# Altium project FPGA Board.PrjPcb (part 4 of 4)
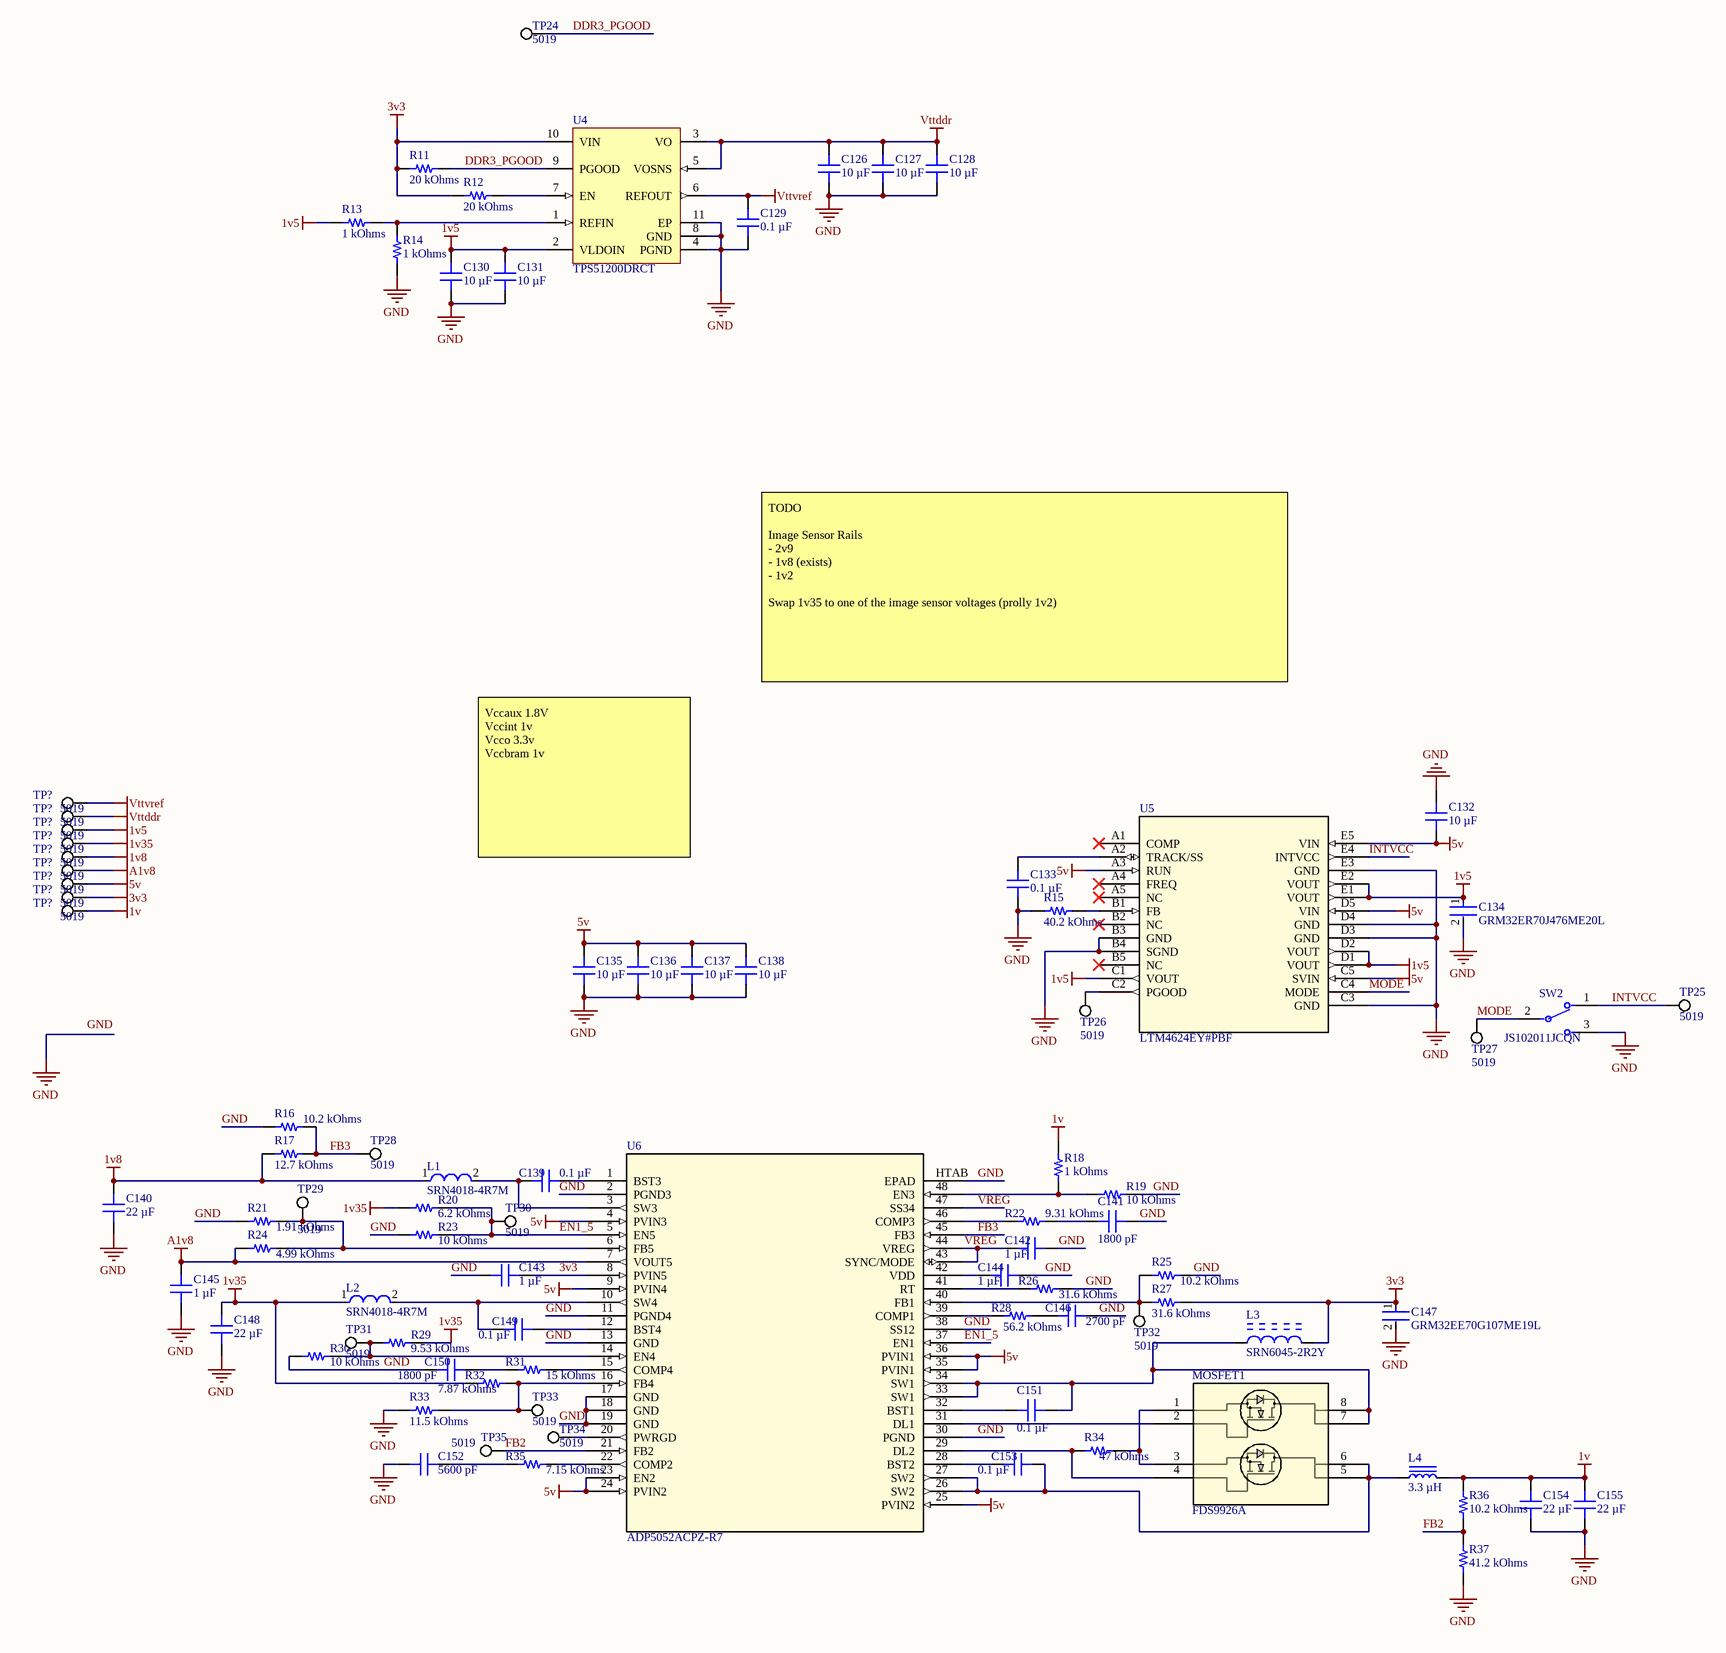
[diagram p8: FPGA Power.SchDoc]

## Nets that join several sheets
3v3: FPGA Board Top (6 pins), A200T Top Level (78 pins), FPGA RAM (J1.199), Motherboard Connection (J2.15 J2.16 J2.17 J2.18), FPGA Power (9 pins)
5v: Motherboard Connection (10 pins), FPGA Power (17 pins)
A1v8: A200T Top Level (C123.2 FB2.1), Motherboard Connection (J2.21), FPGA Power (C145.1 R24.1 TP?#6.1 U6.7)
DM0: FPGA Board Top (7 pins), A200T Top Level (202 pins), FPGA RAM (87 pins), Motherboard Connection (42 pins), FPGA Power (56 pins)
Vccaux: A200T Top Level (14 pins), Motherboard Connection (J2.11 J2.12), FPGA Power (C140.2 L1.1 R17.1 TP?#5.1)
Vccbram: A200T Top Level (48 pins), Motherboard Connection (J2.1 J2.2 J2.3 J2.4), FPGA Power (6 pins)
Vdd: A200T Top Level (18 pins), FPGA RAM (29 pins), Motherboard Connection (J2.107 J2.109), FPGA Power (11 pins)
Vrefca: FPGA RAM (J1.1 J1.126), Motherboard Connection (J2.113), FPGA Power (C129.2 TP?#1.1 U4.6)
Vtt: FPGA RAM (14 pins), Motherboard Connection (J2.111), FPGA Power (6 pins)
A0: A200T Top Level (U2.K22), FPGA RAM (J1.98)
A1: A200T Top Level (U2.K21), FPGA RAM (J1.97)
A2: A200T Top Level (U2.G20), FPGA RAM (J1.96)
A3: A200T Top Level (U2.H20), FPGA RAM (J1.95)
A4: A200T Top Level (U2.H22), FPGA RAM (J1.92)
A5: A200T Top Level (U2.J22), FPGA RAM (J1.91)
A6: A200T Top Level (U2.H18), FPGA RAM (J1.90)
A7: A200T Top Level (U2.H17), FPGA RAM (J1.86)
A8: A200T Top Level (U2.H15), FPGA RAM (J1.89)
A9: A200T Top Level (U2.J15), FPGA RAM (J1.85)
A10: A200T Top Level (U2.G18), FPGA RAM (J1.107)
A11: A200T Top Level (U2.G17), FPGA RAM (J1.84)
A12: A200T Top Level (U2.G16), FPGA RAM (J1.83)
A13: A200T Top Level (U2.G15), FPGA RAM (J1.119)
A14: A200T Top Level (U2.G13), FPGA RAM (J1.80)
A15: A200T Top Level (U2.H13), FPGA RAM (J1.78)
B0: A200T Top Level (U2.AB2), Motherboard Connection (J2.53)
B1: A200T Top Level (U2.Y3), Motherboard Connection (J2.55)
B2: A200T Top Level (U2.AA3), Motherboard Connection (J2.57)
B3: A200T Top Level (U2.AA5), Motherboard Connection (J2.59)
B4: A200T Top Level (U2.AB5), Motherboard Connection (J2.54)
B5: A200T Top Level (U2.Y4), Motherboard Connection (J2.56)
B6: A200T Top Level (U2.AA4), Motherboard Connection (J2.58)
B7: A200T Top Level (U2.V4), Motherboard Connection (J2.60)
BA0: A200T Top Level (U2.J20), FPGA RAM (J1.109)
BA1: A200T Top Level (U2.L21), FPGA RAM (J1.108)
BA2: A200T Top Level (U2.M21), FPGA RAM (J1.79)
CAS: A200T Top Level (U2.J19), FPGA RAM (J1.115)
CCLK: A200T Top Level (U2.L12), Motherboard Connection (J2.30)
CK0_N: A200T Top Level (U2.H14), FPGA RAM (J1.103)
CK0_P: A200T Top Level (U2.J14), FPGA RAM (J1.101)
CK1_N: A200T Top Level (U2.N19), FPGA RAM (J1.104)
CK1_P: A200T Top Level (U2.N18), FPGA RAM (J1.102)
CKE0: A200T Top Level (U2.M22), FPGA RAM (J1.73 R8.1)
CKE1: A200T Top Level (U2.K18), FPGA RAM (J1.74 R7.1)
CLK0: FPGA Board Top (Q1.3), A200T Top Level (U2.T5)
CS0: A200T Top Level (U2.N22), FPGA RAM (J1.114)
CS1: A200T Top Level (U2.K19), FPGA RAM (J1.121)
D2: A200T Top Level (U2.P21), Motherboard Connection (J2.33)
D3: A200T Top Level (U2.R21), Motherboard Connection (J2.34)
DCLK: A200T Top Level (U2.AA8), Motherboard Connection (J2.67)
DE: A200T Top Level (U2.W9), Motherboard Connection (J2.68)
DISP: A200T Top Level (U2.Y7), Motherboard Connection (J2.66)
DONE: A200T Top Level (5 pins), Motherboard Connection (J2.96)
DQ0: A200T Top Level (U2.F13), FPGA RAM (J1.5)
DQ1: A200T Top Level (U2.F14), FPGA RAM (J1.7)
DQ2: A200T Top Level (U2.F16), FPGA RAM (J1.15)
DQ3: A200T Top Level (U2.E17), FPGA RAM (J1.17)
DQ4: A200T Top Level (U2.E13), FPGA RAM (J1.4)
DQ5: A200T Top Level (U2.E14), FPGA RAM (J1.6)
DQ6: A200T Top Level (U2.E16), FPGA RAM (J1.16)
DQ7: A200T Top Level (U2.D16), FPGA RAM (J1.18)
DQ8: A200T Top Level (U2.B15), FPGA RAM (J1.21)
DQ9: A200T Top Level (U2.B16), FPGA RAM (J1.23)
DQ10: A200T Top Level (U2.C13), FPGA RAM (J1.33)
DQ11: A200T Top Level (U2.B13), FPGA RAM (J1.35)
DQ12: A200T Top Level (U2.A13), FPGA RAM (J1.22)
DQ13: A200T Top Level (U2.A14), FPGA RAM (J1.24)
DQ14: A200T Top Level (U2.B17), FPGA RAM (J1.34)
DQ15: A200T Top Level (U2.B18), FPGA RAM (J1.36)
DQ16: A200T Top Level (U2.E19), FPGA RAM (J1.39)
DQ17: A200T Top Level (U2.D19), FPGA RAM (J1.41)
DQ18: A200T Top Level (U2.B20), FPGA RAM (J1.51)
DQ19: A200T Top Level (U2.A20), FPGA RAM (J1.53)
DQ20: A200T Top Level (U2.A18), FPGA RAM (J1.40)
DQ21: A200T Top Level (U2.A19), FPGA RAM (J1.42)
DQ22: A200T Top Level (U2.F19), FPGA RAM (J1.50)
DQ23: A200T Top Level (U2.F20), FPGA RAM (J1.52)
DQ24: A200T Top Level (U2.D20), FPGA RAM (J1.57)
DQ25: A200T Top Level (U2.C20), FPGA RAM (J1.59)
DQ26: A200T Top Level (U2.C22), FPGA RAM (J1.67)
DQ27: A200T Top Level (U2.B22), FPGA RAM (J1.69)
DQ28: A200T Top Level (U2.E22), FPGA RAM (J1.56)
DQ29: A200T Top Level (U2.D22), FPGA RAM (J1.58)
DQ30: A200T Top Level (U2.E21), FPGA RAM (J1.68)
DQ31: A200T Top Level (U2.D21), FPGA RAM (J1.70)
DQ32: A200T Top Level (U2.K13), FPGA RAM (J1.129)
DQ33: A200T Top Level (U2.K14), FPGA RAM (J1.131)
DQ34: A200T Top Level (U2.M13), FPGA RAM (J1.141)
DQ35: A200T Top Level (U2.L13), FPGA RAM (J1.143)
DQ36: A200T Top Level (U2.L14), FPGA RAM (J1.130)
DQ37: A200T Top Level (U2.L15), FPGA RAM (J1.132)
DQ38: A200T Top Level (U2.L16), FPGA RAM (J1.140)
DQ39: A200T Top Level (U2.K16), FPGA RAM (J1.142)
DQ40: A200T Top Level (U2.W21), FPGA RAM (J1.147)
DQ41: A200T Top Level (U2.W22), FPGA RAM (J1.149)
DQ42: A200T Top Level (U2.AA20), FPGA RAM (J1.157)
DQ43: A200T Top Level (U2.AA21), FPGA RAM (J1.159)
DQ44: A200T Top Level (U2.AB21), FPGA RAM (J1.146)
DQ45: A200T Top Level (U2.AB22), FPGA RAM (J1.148)
DQ46: A200T Top Level (U2.U20), FPGA RAM (J1.158)
DQ47: A200T Top Level (U2.V20), FPGA RAM (J1.160)
DQ48: A200T Top Level (U2.V18), FPGA RAM (J1.163)
DQ49: A200T Top Level (U2.V19), FPGA RAM (J1.165)
DQ50: A200T Top Level (U2.V17), FPGA RAM (J1.175)
DQ51: A200T Top Level (U2.W17), FPGA RAM (J1.177)
DQ52: A200T Top Level (U2.AA18), FPGA RAM (J1.164)
DQ53: A200T Top Level (U2.AB18), FPGA RAM (J1.166)
DQ54: A200T Top Level (U2.U17), FPGA RAM (J1.174)
DQ55: A200T Top Level (U2.U18), FPGA RAM (J1.176)
DQ56: A200T Top Level (U2.P14), FPGA RAM (J1.181)
DQ57: A200T Top Level (U2.R14), FPGA RAM (J1.183)
DQ58: A200T Top Level (U2.R18), FPGA RAM (J1.191)
DQ59: A200T Top Level (U2.T18), FPGA RAM (J1.193)
DQ60: A200T Top Level (U2.P15), FPGA RAM (J1.180)
DQ61: A200T Top Level (U2.R16), FPGA RAM (J1.182)
DQ62: A200T Top Level (U2.N13), FPGA RAM (J1.192)
DQ63: A200T Top Level (U2.N14), FPGA RAM (J1.194)
DQS0_N: A200T Top Level (U2.C15), FPGA RAM (J1.10)
DQS0_P: A200T Top Level (U2.C14), FPGA RAM (J1.12)
DQS1_N: A200T Top Level (U2.A16), FPGA RAM (J1.27)
DQS1_P: A200T Top Level (U2.A15), FPGA RAM (J1.29)
DQS2_N: A200T Top Level (U2.E18), FPGA RAM (J1.45)
DQS2_P: A200T Top Level (U2.F18), FPGA RAM (J1.47)
DQS3_N: A200T Top Level (U2.A21), FPGA RAM (J1.62)
DQS3_P: A200T Top Level (U2.B21), FPGA RAM (J1.64)
DQS4_N: A200T Top Level (U2.J17), FPGA RAM (J1.135)
DQS4_P: A200T Top Level (U2.K17), FPGA RAM (J1.137)
DQS5_N: A200T Top Level (U2.Y22), FPGA RAM (J1.152)
DQS5_P: A200T Top Level (U2.Y21), FPGA RAM (J1.154)
DQS6_N: A200T Top Level (U2.AB20), FPGA RAM (J1.169)
DQS6_P: A200T Top Level (U2.AA19), FPGA RAM (J1.171)
DQS7_N: A200T Top Level (U2.P17), FPGA RAM (J1.186)
DQS7_P: A200T Top Level (U2.N17), FPGA RAM (J1.188)
EIO3: A200T Top Level (U2.L18), Motherboard Connection (J2.98)
EIO4: A200T Top Level (U2.M20), Motherboard Connection (J2.99)
EIO5: A200T Top Level (U2.M15), Motherboard Connection (J2.189)
EIO6: A200T Top Level (U2.M16), Motherboard Connection (J2.191)
EIO7: A200T Top Level (U2.M17), Motherboard Connection (J2.192)
EIO8: A200T Top Level (U2.F15), Motherboard Connection (J2.193)
EIO9: A200T Top Level (U2.D15), Motherboard Connection (J2.194)
EIO10: A200T Top Level (U2.D17), Motherboard Connection (J2.196)
EIO11: A200T Top Level (U2.C17), Motherboard Connection (J2.197)
EIO12: A200T Top Level (U2.C18), Motherboard Connection (J2.198)
EIO13: A200T Top Level (U2.C19), Motherboard Connection (J2.199)
EIO14: A200T Top Level (U2.G21), Motherboard Connection (J2.201)
EIO15: A200T Top Level (U2.G22), Motherboard Connection (J2.202)
EIO16: A200T Top Level (U2.F21), Motherboard Connection (J2.203)
EIO17: A200T Top Level (U2.P20), Motherboard Connection (J2.204)
EVENT: FPGA Board Top (TP20.1), FPGA RAM (J1.198 R10.1)
FCS: A200T Top Level (U2.T19), Motherboard Connection (J2.29)
G0: A200T Top Level (U2.Y2), Motherboard Connection (J2.38)
G1: A200T Top Level (U2.W1), Motherboard Connection (J2.40)
G2: A200T Top Level (U2.Y1), Motherboard Connection (J2.42)
G3: A200T Top Level (U2.U3), Motherboard Connection (J2.44)
G4: A200T Top Level (U2.V3), Motherboard Connection (J2.46)
G5: A200T Top Level (U2.AA1), Motherboard Connection (J2.48)
G6: A200T Top Level (U2.AB1), Motherboard Connection (J2.50)
G7: A200T Top Level (U2.AB3), Motherboard Connection (J2.52)
GPIO0: A200T Top Level (U2.T3), Motherboard Connection (J2.37)
GPIO1: A200T Top Level (U2.T1), Motherboard Connection (J2.39)
GPIO2: A200T Top Level (U2.U1), Motherboard Connection (J2.41)
GPIO3: A200T Top Level (U2.U2), Motherboard Connection (J2.43)
GPIO4: A200T Top Level (U2.V2), Motherboard Connection (J2.45)
GPIO5: A200T Top Level (U2.R3), Motherboard Connection (J2.47)
GPIO6: A200T Top Level (U2.R2), Motherboard Connection (J2.49)
GPIO7: A200T Top Level (U2.W2), Motherboard Connection (J2.51)
GPIO24: A200T Top Level (U2.W4), Motherboard Connection (J2.71)
GPIO25: A200T Top Level (U2.R4), Motherboard Connection (J2.73)
GPIO26: A200T Top Level (U2.T4), Motherboard Connection (J2.75)
GPIO27: A200T Top Level (U2.U5), Motherboard Connection (J2.77)
GPIO28: A200T Top Level (U2.W6), Motherboard Connection (J2.79)
GPIO29: A200T Top Level (U2.W5), Motherboard Connection (J2.72)
GPIO30: A200T Top Level (U2.U6), Motherboard Connection (J2.74)
GPIO31: A200T Top Level (U2.V5), Motherboard Connection (J2.76)
GPIO32: A200T Top Level (U2.R6), Motherboard Connection (J2.78)
GPIO33: A200T Top Level (U2.T6), Motherboard Connection (J2.80)
GPIO34: A200T Top Level (U2.Y6), Motherboard Connection (J2.82)
GPIO35: A200T Top Level (U2.AA6), Motherboard Connection (J2.81)
GPIO36: A200T Top Level (U2.V7), Motherboard Connection (J2.83)
GPIO37: A200T Top Level (U2.W7), Motherboard Connection (J2.85)
GPIO38: A200T Top Level (U2.AB7), Motherboard Connection (J2.84)
GPIO39: A200T Top Level (U2.AB6), Motherboard Connection (J2.86)
GPIO40: A200T Top Level (U2.V9), Motherboard Connection (J2.88)
GPIO41: A200T Top Level (U2.V8), Motherboard Connection (J2.87)
GPIO43: A200T Top Level (U2.AB8), Motherboard Connection (J2.63)
GPIO44: A200T Top Level (U2.Y8), Motherboard Connection (J2.64)
GPIO47: A200T Top Level (U2.Y9), Motherboard Connection (J2.100)
GPIO48: A200T Top Level (U2.U7), Motherboard Connection (J2.101)
GPIO49: A200T Top Level (U2.F4), Motherboard Connection (J2.102)
GPIO57: A200T Top Level (U2.D2), Motherboard Connection (J2.112)
GPIO59: A200T Top Level (U2.F1), Motherboard Connection (J2.114)
GPIO60: A200T Top Level (U2.F3), Motherboard Connection (J2.116)
GPIO61: A200T Top Level (U2.E3), Motherboard Connection (J2.117)
GPIO62: A200T Top Level (U2.K1), Motherboard Connection (J2.118)
GPIO63: A200T Top Level (U2.J1), Motherboard Connection (J2.119)
GPIO64: A200T Top Level (U2.H2), Motherboard Connection (J2.121)
GPIO65: A200T Top Level (U2.G2), Motherboard Connection (J2.122)
GPIO66: A200T Top Level (U2.K2), Motherboard Connection (J2.123)
GPIO67: A200T Top Level (U2.J2), Motherboard Connection (J2.124)
GPIO68: A200T Top Level (U2.J5), Motherboard Connection (J2.126)
GPIO69: A200T Top Level (U2.H5), Motherboard Connection (J2.127)
GPIO70: A200T Top Level (U2.H3), Motherboard Connection (J2.128)
GPIO71: A200T Top Level (U2.G3), Motherboard Connection (J2.129)
GPIO72: A200T Top Level (U2.H4), Motherboard Connection (J2.131)
GPIO73: A200T Top Level (U2.G4), Motherboard Connection (J2.132)
GPIO74: A200T Top Level (U2.K4), Motherboard Connection (J2.133)
GPIO75: A200T Top Level (U2.J4), Motherboard Connection (J2.134)
GPIO76: A200T Top Level (U2.L3), Motherboard Connection (J2.136)
GPIO77: A200T Top Level (U2.K3), Motherboard Connection (J2.137)
GPIO78: A200T Top Level (U2.M1), Motherboard Connection (J2.138)
GPIO79: A200T Top Level (U2.L1), Motherboard Connection (J2.139)
GPIO80: A200T Top Level (U2.M3), Motherboard Connection (J2.141)
GPIO81: A200T Top Level (U2.M2), Motherboard Connection (J2.142)
GPIO82: A200T Top Level (U2.K6), Motherboard Connection (J2.143)
GPIO83: A200T Top Level (U2.J6), Motherboard Connection (J2.144)
GPIO84: A200T Top Level (U2.L5), Motherboard Connection (J2.146)
GPIO85: A200T Top Level (U2.L4), Motherboard Connection (J2.147)
GPIO86: A200T Top Level (U2.N4), Motherboard Connection (J2.148)
GPIO87: A200T Top Level (U2.N3), Motherboard Connection (J2.149)
GPIO88: A200T Top Level (U2.R1), Motherboard Connection (J2.151)
GPIO89: A200T Top Level (U2.P1), Motherboard Connection (J2.152)
GPIO90: A200T Top Level (U2.P5), Motherboard Connection (J2.153)
GPIO91: A200T Top Level (U2.P4), Motherboard Connection (J2.154)
GPIO92: A200T Top Level (U2.P2), Motherboard Connection (J2.156)
GPIO93: A200T Top Level (U2.N2), Motherboard Connection (J2.157)
GPIO94: A200T Top Level (U2.M6), Motherboard Connection (J2.158)
GPIO95: A200T Top Level (U2.M5), Motherboard Connection (J2.159)
GPIO96: A200T Top Level (U2.P6), Motherboard Connection (J2.161)
GPIO97: A200T Top Level (U2.N5), Motherboard Connection (J2.162)
GPIO98: A200T Top Level (U2.L6), Motherboard Connection (J2.163)
GPIO99: A200T Top Level (U2.AA9), Motherboard Connection (J2.164)
GPIO100: A200T Top Level (U2.AB10), Motherboard Connection (J2.166)
GPIO101: A200T Top Level (U2.AA10), Motherboard Connection (J2.167)
GPIO102: A200T Top Level (U2.AA11), Motherboard Connection (J2.168)
GPIO103: A200T Top Level (U2.V10), Motherboard Connection (J2.169)
GPIO104: A200T Top Level (U2.W10), Motherboard Connection (J2.171)
GPIO105: A200T Top Level (U2.Y11), Motherboard Connection (J2.172)
GPIO106: A200T Top Level (U2.Y12), Motherboard Connection (J2.173)
GPIO107: A200T Top Level (U2.W11), Motherboard Connection (J2.174)
GPIO108: A200T Top Level (U2.W12), Motherboard Connection (J2.176)
GPIO109: A200T Top Level (U2.V13), Motherboard Connection (J2.177)
GPIO110: A200T Top Level (U2.V14), Motherboard Connection (J2.178)
GPIO111: A200T Top Level (U2.U15), Motherboard Connection (J2.179)
GPIO112: A200T Top Level (U2.V15), Motherboard Connection (J2.181)
GPIO114: A200T Top Level (U2.T15), Motherboard Connection (J2.183)
GPIO117: A200T Top Level (U2.T16), Motherboard Connection (J2.187)
INIT: A200T Top Level (R2.1 U2.U12), Motherboard Connection (J2.95)
M0: FPGA Board Top (R4.2 SW1.6 TP21.1), A200T Top Level (U2.U11)
M1: FPGA Board Top (R5.2 SW1.5 TP22.1), A200T Top Level (U2.U10)
M2: FPGA Board Top (R6.2 SW1.4 TP23.1), A200T Top Level (U2.U9)
MISO: A200T Top Level (U2.R22), Motherboard Connection (J2.31)
MOSI: A200T Top Level (U2.P22), Motherboard Connection (J2.32)
ODT0: A200T Top Level (U2.M18), FPGA RAM (J1.116)
ODT1: A200T Top Level (U2.N20), FPGA RAM (J1.120)
PROGRAM: A200T Top Level (R3.1 U2.N12), Motherboard Connection (J2.97)
RAS: A200T Top Level (U2.J21), FPGA RAM (J1.110)
RESET: A200T Top Level (U2.D14), FPGA RAM (J1.30 R9.1)
SCL: FPGA Board Top (P5.3), FPGA RAM (J1.202)
SDA: FPGA Board Top (P5.1), FPGA RAM (J1.200)
TCK: FPGA Board Top (P4.2), A200T Top Level (U2.V12), Motherboard Connection (J2.25)
TDI: FPGA Board Top (P4.3), A200T Top Level (U2.R13), Motherboard Connection (J2.24)
TDO: FPGA Board Top (P4.1), A200T Top Level (U2.U13), Motherboard Connection (J2.26)
TMS: FPGA Board Top (P4.4), A200T Top Level (U2.T13), Motherboard Connection (J2.22)
VN: A200T Top Level (U2.M9), Motherboard Connection (J2.92)
VP: A200T Top Level (U2.L10), Motherboard Connection (J2.91)
WE: A200T Top Level (U2.H19), FPGA RAM (J1.113)